# Altium project BMS.PrjPcb (part 1 of 2)
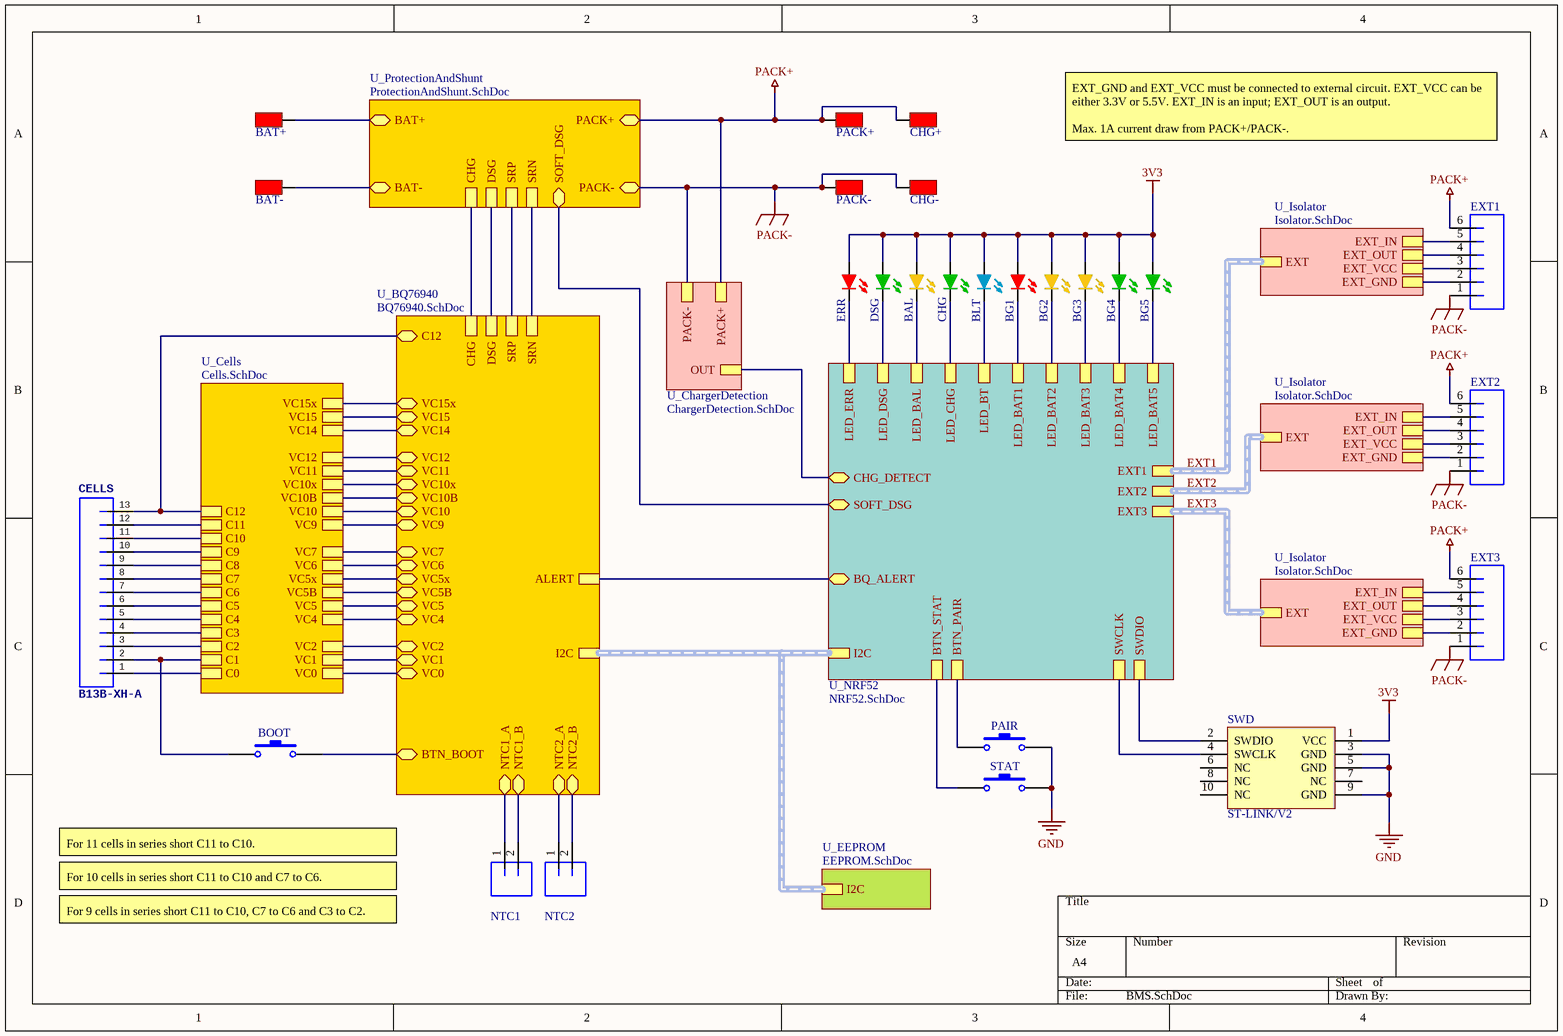
[diagram p0: BMS.SchDoc]
8 sheets, 242 parts. Net scope: hierarchical (ports join the sheet entries above them; power ports are global).
Board file: BMS.PcbDoc
Sheets:
  BMS.SchDoc
    U_BQ76940 = BQ76940.SchDoc
    U_ProtectionAndShunt = ProtectionAndShunt.SchDoc
    U_Isolator = Isolator.SchDoc
    U_Isolator = Isolator.SchDoc
    U_Isolator = Isolator.SchDoc
    U_EEPROM = EEPROM.SchDoc
    U_NRF52 = NRF52.SchDoc
    U_Cells = Cells.SchDoc
    U_ChargerDetection = ChargerDetection.SchDoc

## Sheet BMS.SchDoc
size A4

### Parts
BAL  LED  [LED0603]  (value not drawn)
BAT+  WIRE_LARGE  [WIRE_LARGE]  (value not drawn)
BAT-  WIRE_LARGE  [WIRE_LARGE]  (value not drawn)
BG1  LED  [LED0603]  (value not drawn)
BG2  LED  [LED0603]  (value not drawn)
BG3  LED  [LED0603]  (value not drawn)
BG4  LED  [LED0603]  (value not drawn)
BG5  LED  [LED0603]  (value not drawn)
BLT  LED  [LED0603]  (value not drawn)
BOOT  Button  [BUTTON]  (value not drawn)
CELLS  B13B-XH-A  [JST-13-PTH-VERT]
CHG  LED  [LED0603]  (value not drawn)
CHG+  WIRE_MEDIUM  [WIRE_MEDIUM]  (value not drawn)
CHG-  WIRE_MEDIUM  [WIRE_MEDIUM]  (value not drawn)
DSG  LED  [LED0603]  (value not drawn)
ERR  LED  [LED0603]  (value not drawn)
EXT1  EXT  [JST B6B-PH-K]  (value not drawn)
EXT2  EXT  [JST B6B-PH-K]  (value not drawn)
EXT3  EXT  [JST B6B-PH-K]  (value not drawn)
NTC1  TEMP  [JST-2-PTH-VERT]  (value not drawn)
NTC2  TEMP  [JST-2-PTH-VERT]  (value not drawn)
PACK+  WIRE_LARGE  [WIRE_LARGE]  (value not drawn)
PACK-  WIRE_LARGE  [WIRE_LARGE]  (value not drawn)
PAIR  Button  [BUTTON]  (value not drawn)
STAT  Button  [BUTTON]  (value not drawn)
SWD  ST-LINK/V2  [SWD]

### Sub-sheets
U_BQ76940 = BQ76940.SchDoc: ALERT, I2C (harness I2C), CHG, DSG, SRP, SRN, C12, VC10, VC7, VC5x, VC5B, VC1, VC2, VC15x, VC9, VC10x, VC5, VC12, VC6, VC10B, VC14, VC11, VC4, VC15, VC0, BTN_BOOT, NTC2_B, NTC1_A, NTC2_A, NTC1_B
U_Cells = Cells.SchDoc: VC15x, VC10x, VC5x, VC10, VC5, VC0, VC1, VC2, VC4, VC5B, VC6, VC7, VC9, VC10B, VC11, VC12, VC14, VC15, C11, C10, C9, C8, C7, C6, C5, C4, C3, C2, C1, C0, C12
U_ChargerDetection = ChargerDetection.SchDoc: PACK-, PACK+, OUT
U_EEPROM = EEPROM.SchDoc: I2C (harness I2C)
U_Isolator = Isolator.SchDoc: EXT (harness EXT), EXT_IN, EXT_OUT, EXT_VCC, EXT_GND
U_Isolator = Isolator.SchDoc: EXT (harness EXT), EXT_IN, EXT_OUT, EXT_VCC, EXT_GND
U_Isolator = Isolator.SchDoc: EXT (harness EXT), EXT_IN, EXT_OUT, EXT_VCC, EXT_GND
U_NRF52 = NRF52.SchDoc: SWDIO, SWCLK, BTN_PAIR, BTN_STAT, LED_BAT1, LED_BAT2, LED_BAT3, LED_BAT4, LED_BAT5, LED_CHG, LED_DSG, LED_BAL, LED_BT, LED_ERR, EXT3 (harness EXT), EXT2 (harness EXT), EXT1 (harness EXT), I2C (harness I2C), BQ_ALERT, CHG_DETECT, SOFT_DSG
U_ProtectionAndShunt = ProtectionAndShunt.SchDoc: SRP, SRN, CHG, DSG, BAT+, PACK+, PACK-, BAT-, SOFT_DSG

### Nets
3V3: BAL.A BG1.A BG2.A BG3.A BG4.A BG5.A BLT.A CHG.A DSG.A ERR.A SWD.1(VCC)
GND: PAIR.2 STAT.2 SWD.3(GND) SWD.5(GND) SWD.9(GND)
PACK+: BAT+.1 CHG+.1 EXT1.6 EXT2.6 EXT3.6 PACK+.1 ; sheet U_ProtectionAndShunt/BAT+, sheet U_ProtectionAndShunt/PACK+, sheet U_ChargerDetection/PACK+
PACK-: CHG-.1 EXT1.1 EXT2.1 EXT3.1 PACK-.1 ; sheet U_ProtectionAndShunt/PACK-, sheet U_ChargerDetection/PACK-
ALERT: sheet U_BQ76940/ALERT, sheet U_NRF52/BQ_ALERT
BAT-: BAT-.1 ; sheet U_ProtectionAndShunt/BAT-
BTN_BOOT: BOOT.2 ; sheet U_BQ76940/BTN_BOOT
BTN_PAIR: PAIR.1 ; sheet U_NRF52/BTN_PAIR
BTN_STAT: STAT.1 ; sheet U_NRF52/BTN_STAT
C0: CELLS.1 ; sheet U_Cells/C0
C1: BOOT.1 CELLS.2 ; sheet U_Cells/C1
C2: CELLS.3 ; sheet U_Cells/C2
C3: CELLS.4 ; sheet U_Cells/C3
C4: CELLS.5 ; sheet U_Cells/C4
C5: CELLS.6 ; sheet U_Cells/C5
C6: CELLS.7 ; sheet U_Cells/C6
C7: CELLS.8 ; sheet U_Cells/C7
C8: CELLS.9 ; sheet U_Cells/C8
C9: CELLS.10 ; sheet U_Cells/C9
C10: CELLS.11 ; sheet U_Cells/C10
C11: CELLS.12 ; sheet U_Cells/C11
C12: CELLS.13 ; sheet U_BQ76940/C12, sheet U_Cells/C12
CHG: sheet U_BQ76940/CHG, sheet U_ProtectionAndShunt/CHG
CHG_DETECT: sheet U_NRF52/CHG_DETECT, sheet U_ChargerDetection/OUT
DSG: sheet U_BQ76940/DSG, sheet U_ProtectionAndShunt/DSG
EXT_GND: EXT1.2 ; sheet U_Isolator/EXT_GND
EXT_GND: EXT2.2 ; sheet U_Isolator/EXT_GND  [a separate net that carries the same name]
EXT_GND: EXT3.2 ; sheet U_Isolator/EXT_GND  [a separate net that carries the same name]
EXT_IN: EXT1.5 ; sheet U_Isolator/EXT_IN
EXT_IN: EXT2.5 ; sheet U_Isolator/EXT_IN  [a separate net that carries the same name]
EXT_IN: EXT3.5 ; sheet U_Isolator/EXT_IN  [a separate net that carries the same name]
EXT_OUT: EXT1.4 ; sheet U_Isolator/EXT_OUT
EXT_OUT: EXT2.4 ; sheet U_Isolator/EXT_OUT  [a separate net that carries the same name]
EXT_OUT: EXT3.4 ; sheet U_Isolator/EXT_OUT  [a separate net that carries the same name]
EXT_VCC: EXT1.3 ; sheet U_Isolator/EXT_VCC
EXT_VCC: EXT2.3 ; sheet U_Isolator/EXT_VCC  [a separate net that carries the same name]
EXT_VCC: EXT3.3 ; sheet U_Isolator/EXT_VCC  [a separate net that carries the same name]
LED_BAL: BAL.C ; sheet U_NRF52/LED_BAL
LED_BAT1: BG1.C ; sheet U_NRF52/LED_BAT1
LED_BAT2: BG2.C ; sheet U_NRF52/LED_BAT2
LED_BAT3: BG3.C ; sheet U_NRF52/LED_BAT3
LED_BAT4: BG4.C ; sheet U_NRF52/LED_BAT4
LED_BAT5: BG5.C ; sheet U_NRF52/LED_BAT5
LED_BT: BLT.C ; sheet U_NRF52/LED_BT
LED_CHG: CHG.C ; sheet U_NRF52/LED_CHG
LED_DSG: DSG.C ; sheet U_NRF52/LED_DSG
LED_ERR: ERR.C ; sheet U_NRF52/LED_ERR
NTC1_A: NTC1.1 ; sheet U_BQ76940/NTC1_A
NTC2_A: NTC2.1 ; sheet U_BQ76940/NTC2_A
SOFT_DSG: sheet U_ProtectionAndShunt/SOFT_DSG, sheet U_NRF52/SOFT_DSG
SRN: sheet U_BQ76940/SRN, sheet U_ProtectionAndShunt/SRN
SRP: sheet U_BQ76940/SRP, sheet U_ProtectionAndShunt/SRP
SWCLK: SWD.4(SWCLK) ; sheet U_NRF52/SWCLK
SWDIO: SWD.2(SWDIO) ; sheet U_NRF52/SWDIO
VC0: sheet U_BQ76940/VC0, sheet U_Cells/VC0
VC1: sheet U_BQ76940/VC1, sheet U_Cells/VC1
VC2: sheet U_BQ76940/VC2, sheet U_Cells/VC2
VC4: sheet U_BQ76940/VC4, sheet U_Cells/VC4
VC5: sheet U_BQ76940/VC5, sheet U_Cells/VC5
VC5B: sheet U_BQ76940/VC5B, sheet U_Cells/VC5B
VC5x: NTC2.2 ; sheet U_BQ76940/VC5x, sheet U_BQ76940/NTC2_B, sheet U_Cells/VC5x
VC6: sheet U_BQ76940/VC6, sheet U_Cells/VC6
VC7: sheet U_BQ76940/VC7, sheet U_Cells/VC7
VC9: sheet U_BQ76940/VC9, sheet U_Cells/VC9
VC10: sheet U_BQ76940/VC10, sheet U_Cells/VC10
VC10B: sheet U_BQ76940/VC10B, sheet U_Cells/VC10B
VC10x: NTC1.2 ; sheet U_BQ76940/VC10x, sheet U_BQ76940/NTC1_B, sheet U_Cells/VC10x
VC11: sheet U_BQ76940/VC11, sheet U_Cells/VC11
VC12: sheet U_BQ76940/VC12, sheet U_Cells/VC12
VC14: sheet U_BQ76940/VC14, sheet U_Cells/VC14
VC15: sheet U_BQ76940/VC15, sheet U_Cells/VC15
VC15x: sheet U_BQ76940/VC15x, sheet U_Cells/VC15x

Not connected (* = marked no-connect by the designer): SWD 6(NC) 7(NC) 8(NC) 10(NC)

### Buses and harness runs
harness EXT1 = sheet U_Isolator/EXT = sheet U_NRF52/EXT1
harness EXT2 = sheet U_Isolator/EXT = sheet U_NRF52/EXT2
harness EXT3 = sheet U_Isolator/EXT = sheet U_NRF52/EXT3
harness sheet U_BQ76940/I2C = sheet U_EEPROM/I2C = sheet U_NRF52/I2C

### Notes on the sheet
- EXT_GND and EXT_VCC must be connected to external circuit. EXT_VCC can be either 3.3V or 5.5V. EXT_IN is an input; EXT_OUT is an output.
  Max. 1A current draw from PACK+/PACK-.
- For 11 cells in series short C11 to C10.
- For 10 cells in series short C11 to C10 and C7 to C6.
- For 9 cells in series short C11 to C10, C7 to C6 and C3 to C2.

### Library data of the parts
BAL BG2 BG3 = LED_YELLOW: PartNumber: LTST-C193TGKT-5A; Manufacturer: Lite-On Inc.; PackageReference: 0603; PackageDescription: 0603 (1608 Metric); Mounting Technology: Surface Mount
BG1 ERR = LED_RED: PartNumber: LTST-C193TGKT-5A; Manufacturer: Lite-On Inc.; PackageReference: 0603; PackageDescription: 0603 (1608 Metric); Mounting Technology: Surface Mount
BG4 BG5 CHG DSG = LED_GREEN: PartNumber: LTST-C193TGKT-5A; Manufacturer: Lite-On Inc.; PackageReference: 0603; PackageDescription: 0603 (1608 Metric); Mounting Technology: Surface Mount
BLT = LED_BLUE: PartNumber: LTST-C193TGKT-5A; Manufacturer: Lite-On Inc.; PackageReference: 0603; PackageDescription: 0603 (1608 Metric); Mounting Technology: Surface Mount
BOOT PAIR STAT = BUTTON: Push Button; pin to pad: 2>3; Published: 24-Mar-1999; LatestRevisionDate: 17-Jul-2002; LatestRevisionNote: Re-released for DXP Platform.; PackageReference: SPST-2; Publisher: Altium Limited; PackageDescription: Switch; 2 Leads
CELLS = JST_XH_13
EXT1-EXT3 = JST_PH_6_VERT: Manufacturer: JST Sales America, Inc.; Mounting Technology: Through Hole; PackageReference: JST-PH
NTC1 NTC2 = JST_PH_2_VERT: Manufacturer: JST Sales America, Inc.; PartNumber: B2B-PH-K-S(LF)(SN); Mounting Technology: Through Hole; PackageReference: JST-PH
SWD = SWD Connector

## Sheet BQ76940.SchDoc
size A4
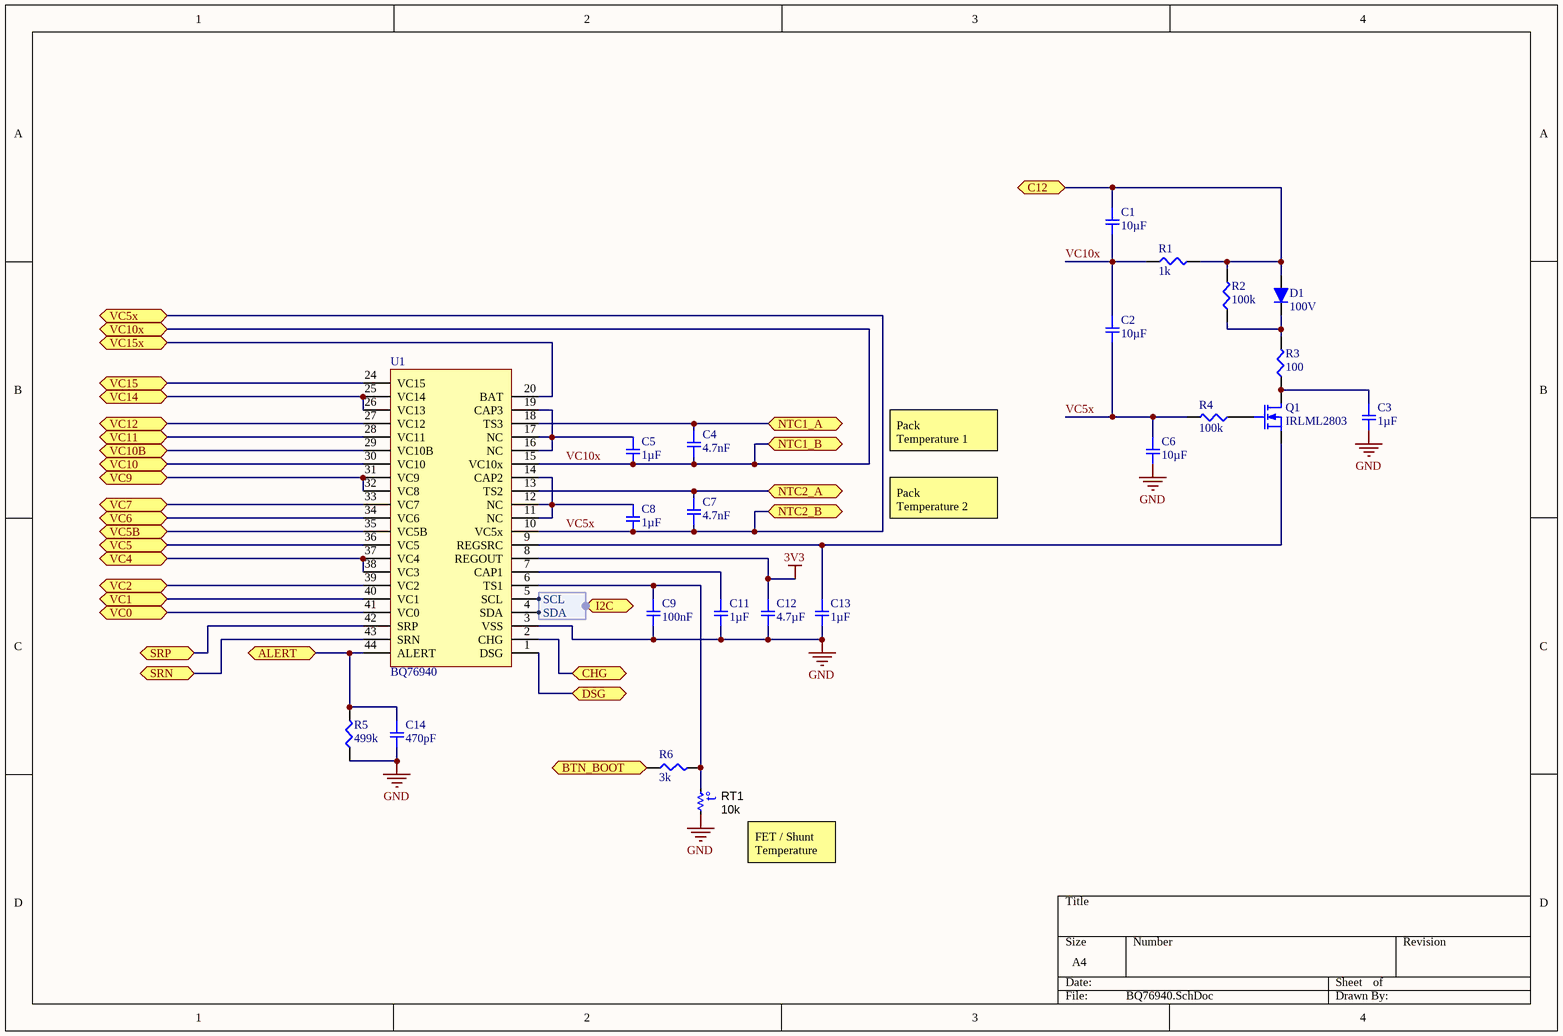
[diagram p1: BQ76940.SchDoc]

### Parts
C1  10µF  [SMD-0603C]
C2  10µF  [SMD-0603C]
C3  1µF  [SMD-0603C]
C4  4.7nF  [SMD-0603C]
C5  1µF  [SMD-0603C]
C6  10µF  [SMD-0603C]
C7  4.7nF  [SMD-0603C]
C8  1µF  [SMD-0603C]
C9  100nF  [SMD-0603C]
C11  1µF  [SMD-0603C]
C12  4.7µF  [SMD-0603C]
C13  1µF  [SMD-0603C]
C14  470pF  [SMD-0603C]
D1  100V  [SOD-323]
Q1  IRLML2803  [SOT23-3]
R1  1k  [SMD-0603-RES]
R2  100k  [SMD-0603-RES]
R3  100  [SMD-0603-RES]
R4  100k  [SMD-0603-RES]
R5  499k  [SMD-0603-RES]
R6  3k  [SMD-0603-RES]
RT1  value 10k  [SMD-0603-RES]  (hidden comment: NTC)
U1  BQ76940  [TSSOP44]

### Ports
ALERT, BTN_BOOT, C12, CHG, DSG, I2C (harness I2C), NTC1_A, NTC1_B, NTC2_A, NTC2_B, SRN, SRP, VC0, VC1, VC2, VC4, VC5, VC5B, VC5x, VC6, VC7, VC9, VC10, VC10B, VC10x, VC11, VC12, VC14, VC15, VC15x

### Harnesses
I2C: SCL, SDA

### Nets
3V3: C12.1 U1.8(REGOUT)
GND: C3.2 C6.2 C9.2 C11.2 C12.2 C13.2 C14.2 R5.1 RT1.1 U1.3(VSS)
ALERT: C14.1 R5.2 U1.44(ALERT) ; port ALERT
BTN_BOOT: R6.1 ; port BTN_BOOT
C12: C1.1 D1.2(A) R1.2 R2.2 ; port C12
CHG: U1.2(CHG) ; port CHG
DSG: U1.1(DSG) ; port DSG
NTC1_A: C4.1 U1.18(TS3) ; port NTC1_A
NTC2_A: C7.1 U1.13(TS2) ; port NTC2_A
SRN: U1.43(SRN) ; port SRN
SRP: U1.42(SRP) ; port SRP
VC0: U1.41(VC0) ; port VC0
VC1: U1.40(VC1) ; port VC1
VC2: U1.39(VC2) ; port VC2
VC4: U1.37(VC4) U1.38(VC3) ; port VC4
VC5: U1.36(VC5) ; port VC5
VC5B: U1.35(VC5B) ; port VC5B
VC5x: C2.2 C6.1 C7.2 C8.2 R4.2 U1.10(VC5x) ; port VC5x, port NTC2_B
VC6: U1.34(VC6) ; port VC6
VC7: U1.33(VC7) ; port VC7
VC9: U1.31(VC9) U1.32(VC8) ; port VC9
VC10: U1.30(VC10) ; port VC10
VC10B: U1.29(VC10B) ; port VC10B
VC10x: C1.2 C2.1 C4.2 C5.2 R1.1 U1.15(VC10x) ; port VC10x, port NTC1_B
VC11: U1.28(VC11) ; port VC11
VC12: U1.27(VC12) ; port VC12
VC14: U1.25(VC14) U1.26(VC13) ; port VC14
VC15: U1.24(VC15) ; port VC15
VC15x: U1.20(BAT) ; port VC15x
NetC3_1: C3.1 Q1.3(D) R3.1
NetC5_1: C5.1 U1.16(NC) U1.17(NC) U1.19(CAP3)
NetC8_1: C8.1 U1.11(NC) U1.12(NC) U1.14(CAP2)
NetC9_1: C9.1 R6.2 RT1.2 U1.6(TS1)
NetC11_1: C11.1 U1.7(CAP1)
NetC13_1: C13.1 Q1.2(S) U1.9(REGSRC)
NetD1_1: D1.1(K) R2.1 R3.2
NetM1_22: U1.4(SDA) ; port I2C.SDA
NetM1_23: U1.5(SCL) ; port I2C.SCL
NetQ1_1: Q1.1(G) R4.1

### Notes on the sheet
- Pack
  Temperature 1
- Pack
  Temperature 2
- (near RT1) FET / Shunt
  Temperature
- (in symbol NTC) t°

### Library data of the parts
C1 C2 C6 = GRM185R60J106ME15D: CAP CER 10UF 6.3V X5R 0603; Manufacturer: Murata Electronics North America; Factory Stock: 0; Unit Price (USD): 0.36; Minimum Quantity: 1; Tolerance: ±20%; Datasheets: http://www.murata.com/~/media/webrenewal/support/library/catalog/products/capacitor/mlcc/c02e.pdf; Image: //media.digikey.com/Renders/Murata%20Renders/ZRB-SERIES-0402.jpg; Digi-Key Part Number: 490-10467-1-ND; Part Number: GRM185R60J106ME15D; Quantity Available: 25068; @ qty: 0; Packaging: Cut Tape (CT); Series: GRM; Part Status: Active; Value: 10µF; Voltage: 6.3V; Temperature Coefficient: X5R; Operating Temperature: -55°C ~ 85°C; Features: Derating Recommended; Ratings: -; Applications: General Purpose; Mounting Type: Surface Mount, MLCC; Package / Case: 0603 (1608 Metric); Size / Dimension: 0.063" L x 0.031" W (1.60mm x 0.80mm); Height - Seated (Max): -; Thickness (Max): 0.022" (0.55mm); Lead Spacing: -; Lead Style: -
C3 C5 C8 C11 C13 = GCM188R71C105KA64D: CAP CER 1UF 16V X7R 0603; Manufacturer: Murata Electronics North America; Factory Stock: 0; Unit Price (USD): 0.24; Minimum Quantity: 1; Tolerance: ±10%; Datasheets: http://www.murata.com/~/media/webrenewal/support/library/catalog/products/capacitor/mlcc/c03e.ashx; Image: //media.digikey.com/Renders/Murata%20Renders/0603%28GCM188%29.jpg; Digi-Key Part Number: 490-5241-1-ND; Part Number: GCM188R71C105KA64D; Quantity Available: 9243; @ qty: 0; Packaging: Cut Tape (CT); Series: GCM; Part Status: Active; Value: 1µF; Voltage: 16V; Temperature Coefficient: X7R; Operating Temperature: -55°C ~ 125°C; Features: -; Ratings: AEC-Q200; Applications: Automotive; Mounting Type: Surface Mount, MLCC; Package / Case: 0603 (1608 Metric); Size / Dimension: 0.063" L x 0.031" W (1.60mm x 0.80mm); Height - Seated (Max): -; Thickness (Max): 0.035" (0.90mm); Lead Spacing: -; Lead Style: -
C4 C7 = GRJ188R71H472KE11D: CAP CER 4700PF 50V X7R 0603; Manufacturer: Murata Electronics North America; Factory Stock: 0; Unit Price (USD): 0.1; Minimum Quantity: 1; Tolerance: ±10%; Datasheets: http://www.murata.com/~/media/webrenewal/support/library/catalog/products/capacitor/mlcc/c02e.pdf; Image: //media.digikey.com/Renders/Murata%20Renders/0603%28LQG18%29.jpg; Digi-Key Part Number: 490-10897-1-ND; Part Number: GRJ188R71H472KE11D; Quantity Available: 7696; @ qty: 0; Packaging: Cut Tape (CT); Series: GRJ; Part Status: Active; Value: 4700pF; Voltage: 50V; Temperature Coefficient: X7R; Operating Temperature: -55°C ~ 125°C; Features: Soft Termination; Ratings: -; Applications: Boardflex Sensitive; Mounting Type: Surface Mount, MLCC; Package / Case: 0603 (1608 Metric); Size / Dimension: 0.063" L x 0.031" W (1.60mm x 0.80mm); Height - Seated (Max): -; Thickness (Max): 0.035" (0.90mm); Lead Spacing: -; Lead Style: -
C9 = GCJ188R71C104KA01D: CAP CER 0.1UF 16V X7R 0603; Manufacturer: Murata Electronics North America; Factory Stock: 0; Unit Price (USD): 0.21; Minimum Quantity: 1; Value: 0.10µF; Tolerance: ±10%; Datasheets: http://www.murata.com/~/media/webrenewal/support/library/catalog/products/capacitor/mlcc/c03e.ashx; Image: //media.digikey.com/Renders/Murata%20Renders/0603%28LQG18%29.jpg; Digi-Key Part Number: 490-5796-1-ND; Part Number: GCJ188R71C104KA01D; Quantity Available: 22473; @ qty: 0; Packaging: Cut Tape (CT); Series: GCJ; Part Status: Active; Voltage: 16V; Temperature Coefficient: X7R; Operating Temperature: -55°C ~ 125°C; Features: Soft Termination; Ratings: AEC-Q200; Applications: Automotive, Boardflex Sensitive; Mounting Type: Surface Mount, MLCC; Package / Case: 0603 (1608 Metric); Size / Dimension: 0.063" L x 0.031" W (1.60mm x 0.80mm); Height - Seated (Max): -; Thickness (Max): 0.035" (0.90mm); Lead Spacing: -; Lead Style: -
C12 = GRJ188C70J475KE11D: CAP CER 4.7UF 6.3V X7S 0603; Manufacturer: Murata Electronics North America; Factory Stock: 0; Unit Price (USD): 0.34; Minimum Quantity: 1; Tolerance: ±10%; Datasheets: http://www.murata.com/~/media/webrenewal/support/library/catalog/products/capacitor/mlcc/c02e.pdf; Image: //media.digikey.com/Renders/Murata%20Renders/0603%28LQG18%29.jpg; Digi-Key Part Number: 490-10884-1-ND; Part Number: GRJ188C70J475KE11D; Quantity Available: 9234; @ qty: 0; Packaging: Cut Tape (CT); Series: GRJ; Part Status: Active; Value: 4.7µF; Voltage: 6.3V; Temperature Coefficient: X7S; Operating Temperature: -55°C ~ 125°C; Features: Soft Termination; Ratings: -; Applications: Boardflex Sensitive; Mounting Type: Surface Mount, MLCC; Package / Case: 0603 (1608 Metric); Size / Dimension: 0.063" L x 0.031" W (1.60mm x 0.80mm); Height - Seated (Max): -; Thickness (Max): 0.039" (1.00mm); Lead Spacing: -; Lead Style: -
C14 = GCM1885C1H471JA16D: CAP CER 470PF 50V NP0 0603; Manufacturer: Murata Electronics North America; Factory Stock: 0; Unit Price (USD): 0.1; Minimum Quantity: 1; Tolerance: ±5%; Temperature Coefficient: C0G, NP0; Datasheets: http://www.murata.com/~/media/webrenewal/support/library/catalog/products/capacitor/mlcc/c03e.ashx; Image: //media.digikey.com/Renders/Murata%20Renders/0603%28GCM188%29.jpg; Digi-Key Part Number: 490-4965-1-ND; Part Number: GCM1885C1H471JA16D; Quantity Available: 32645; @ qty: 0; Packaging: Cut Tape (CT); Series: GCM; Part Status: Active; Value: 470pF; Voltage: 50V; Operating Temperature: -55°C ~ 125°C; Features: -; Ratings: AEC-Q200; Applications: Automotive; Mounting Type: Surface Mount, MLCC; Package / Case: 0603 (1608 Metric); Size / Dimension: 0.063" L x 0.031" W (1.60mm x 0.80mm); Height - Seated (Max): -; Thickness (Max): 0.035" (0.90mm); Lead Spacing: -; Lead Style: -
D1 = DIODE
Q1 = MOSFET-N: N-Channel MOSFET; Published: 8-Jun-2000; LatestRevisionDate: 17-Jul-2002; LatestRevisionNote: Re-released for DXP Platform.; PackageVersion: 1995/1996; PackageReference: E3; Publisher: Altium Limited; PackageDescription: TO, Flat Index; 3 In-Line, Axial Leads; Body Dia. 4.6mm; Lead Dia. 0.5 mm (max)
R1 = ERJ-3EKF1001V: RES SMD 1K OHM 1% 1/10W 0603; Manufacturer: Panasonic Electronic Components; Factory Stock: 0; Unit Price (USD): 0.00379; @ qty: 1500; Minimum Quantity: 1; Power (Watts): 0.1W, 1/10W; Temperature Coefficient: ±100ppm/°C; Part Number: ERJ-3EKF1001V; Datasheets: http://industrial.panasonic.com/www-cgi/jvcr13pz.cgi?E+PZ+3+AOA0002+ERJ3EKF1001V+7+WW; Image: //media.digikey.com/Photos/Panasonic%20Photos/MFG_ERJ-P6W%20Series.jpg; Digi-Key Part Number: P1.00KHCT-ND; Quantity Available: 5218845; Packaging: Cut Tape (CT); Series: ERJ; Part Status: Active; Value: 1k; Tolerance: ±1%; Composition: Thick Film; Features: Automotive AEC-Q200; Operating Temperature: -55°C ~ 155°C; Package / Case: 0603 (1608 Metric); Supplier Device Package: 0603; Size / Dimension: 0.063" L x 0.031" W (1.60mm x 0.80mm); Height - Seated (Max): 0.022" (0.55mm); Number of Terminations: 2; Failure Rate: -
R2 R4 = ERJ-3EKF1003V: RES SMD 100K OHM 1% 1/10W 0603; Manufacturer: Panasonic Electronic Components; Factory Stock: 0; Unit Price (USD): 0.00379; @ qty: 1500; Minimum Quantity: 1; Power (Watts): 0.1W, 1/10W; Temperature Coefficient: ±100ppm/°C; Part Number: ERJ-3EKF1003V; Datasheets: http://industrial.panasonic.com/www-cgi/jvcr13pz.cgi?E+PZ+3+AOA0002+ERJ3EKF1003V+7+WW; Image: //media.digikey.com/Photos/Panasonic%20Photos/MFG_ERJ-P6W%20Series.jpg; Digi-Key Part Number: P100KHCT-ND; Quantity Available: 2179804; Packaging: Cut Tape (CT); Series: ERJ; Part Status: Active; Value: 100k; Tolerance: ±1%; Composition: Thick Film; Features: Automotive AEC-Q200; Operating Temperature: -55°C ~ 155°C; Package / Case: 0603 (1608 Metric); Supplier Device Package: 0603; Size / Dimension: 0.063" L x 0.031" W (1.60mm x 0.80mm); Height - Seated (Max): 0.022" (0.55mm); Number of Terminations: 2; Failure Rate: -
R3 = ERJ-3EKF1000V: RES SMD 100 OHM 1% 1/10W 0603; Manufacturer: Panasonic Electronic Components; Factory Stock: 0; Unit Price (USD): 0.00379; @ qty: 1500; Minimum Quantity: 1; Power (Watts): 0.1W, 1/10W; Temperature Coefficient: ±100ppm/°C; Part Number: ERJ-3EKF1000V; Datasheets: http://industrial.panasonic.com/www-cgi/jvcr13pz.cgi?E+PZ+3+AOA0002+ERJ3EKF1000V+7+WW; Image: //media.digikey.com/Photos/Panasonic%20Photos/MFG_ERJ-P6W%20Series.jpg; Digi-Key Part Number: P100HCT-ND; Quantity Available: 1544120; Packaging: Cut Tape (CT); Series: ERJ; Part Status: Active; Value: 100; Tolerance: ±1%; Composition: Thick Film; Features: Automotive AEC-Q200; Operating Temperature: -55°C ~ 155°C; Package / Case: 0603 (1608 Metric); Supplier Device Package: 0603; Size / Dimension: 0.063" L x 0.031" W (1.60mm x 0.80mm); Height - Seated (Max): 0.022" (0.55mm); Number of Terminations: 2; Failure Rate: -
R5 = ERJ-3EKF4993V: RES SMD 499K OHM 1% 1/10W 0603; Manufacturer: Panasonic Electronic Components; Factory Stock: 0; Unit Price (USD): 0.00379; @ qty: 1500; Minimum Quantity: 1; Power (Watts): 0.1W, 1/10W; Temperature Coefficient: ±100ppm/°C; Part Number: ERJ-3EKF4993V; Datasheets: http://industrial.panasonic.com/www-cgi/jvcr13pz.cgi?E+PZ+3+AOA0002+ERJ3EKF4993V+7+WW; Image: //media.digikey.com/Photos/Panasonic%20Photos/MFG_ERJ-P6W%20Series.jpg; Digi-Key Part Number: P499KHCT-ND; Quantity Available: 110332; Packaging: Cut Tape (CT); Series: ERJ; Part Status: Active; Value: 499k; Tolerance: ±1%; Composition: Thick Film; Features: Automotive AEC-Q200; Operating Temperature: -55°C ~ 155°C; Package / Case: 0603 (1608 Metric); Supplier Device Package: 0603; Size / Dimension: 0.063" L x 0.031" W (1.60mm x 0.80mm); Height - Seated (Max): 0.022" (0.55mm); Number of Terminations: 2; Failure Rate: -
R6 = ERJ-3EKF3001V: RES SMD 3K OHM 1% 1/10W 0603; Manufacturer: Panasonic Electronic Components; Factory Stock: 0; Unit Price (USD): 0.00379; @ qty: 1500; Minimum Quantity: 1; Power (Watts): 0.1W, 1/10W; Temperature Coefficient: ±100ppm/°C; Part Number: ERJ-3EKF3001V; Datasheets: http://industrial.panasonic.com/www-cgi/jvcr13pz.cgi?E+PZ+3+AOA0002+ERJ3EKF3001V+7+WW; Image: //media.digikey.com/Photos/Panasonic%20Photos/MFG_ERJ-P6W%20Series.jpg; Digi-Key Part Number: P3.00KHCT-ND; Quantity Available: 43631; Packaging: Cut Tape (CT); Series: ERJ; Part Status: Active; Value: 3k; Tolerance: ±1%; Composition: Thick Film; Features: Automotive AEC-Q200; Operating Temperature: -55°C ~ 155°C; Package / Case: 0603 (1608 Metric); Supplier Device Package: 0603; Size / Dimension: 0.063" L x 0.031" W (1.60mm x 0.80mm); Height - Seated (Max): 0.022" (0.55mm); Number of Terminations: 2; Failure Rate: -
RT1 = NTC: Thermistor NTC, 10.0k ohm, 1%; Manufacturer: SEMITEC Corporation; PartNumber: 103AT-2; Tolerance_%: 1; Power_W: 0.01; TaMin_C: -50; TaMax_C: 110; U/M: EA; ComponentLink1URL: http://www.semitec.co.jp/english2/products/pdf/AT_Thermistor.pdf; PackageReference: Disc, 5x8.4 mm; SymbolVersion: 2008-11-25; ComponentLink1Description: Datasheet link; CompType: ThermistorNTC; Series: AT; MountType: TH; RoHS: Y; Published: 2009-09-22; Publisher: Texas Instruments; LatestRevisionDate: 2013-08-16; Supplier 1: Mouser; Supplier Part Number 1: 954-103AT-2

## Sheet ProtectionAndShunt.SchDoc
size A4
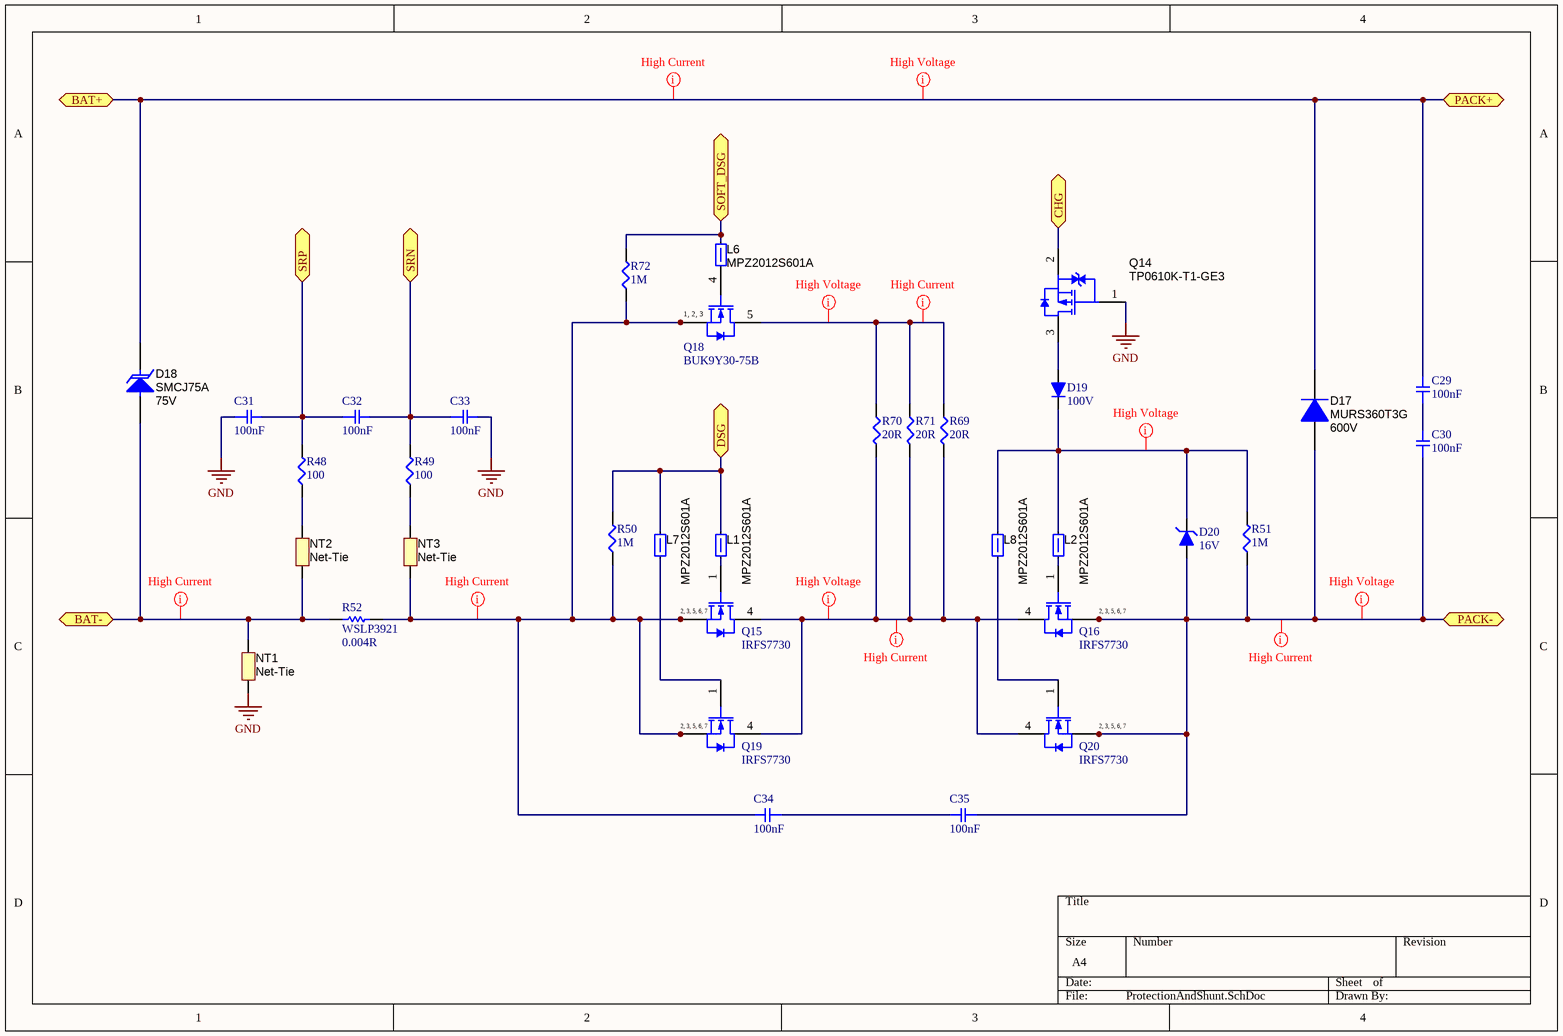
[diagram p2: ProtectionAndShunt.SchDoc]

### Parts
C29  100nF  [SMD-0603C]
C30  100nF  [SMD-0603C]
C31  100nF  [SMD-0603C]
C32  100nF  [SMD-0603C]
C33  100nF  [SMD-0603C]
C34  100nF  [SMD-0603C]
C35  100nF  [SMD-0603C]
D17  MURS360T3G  value 600V  [SMC]
D18  SMCJ75A  value 75V  [SMC]
D19  100V  [SOD-323]
D20  16V  [SOD-323]
L1  MPZ2012S601A  [SMD-0805-RES]
L2  MPZ2012S601A  [SMD-0805-RES]
L6  MPZ2012S601A  [SMD-0805-RES]
L7  MPZ2012S601A  [SMD-0805-RES]
L8  MPZ2012S601A  [SMD-0805-RES]
NT1  Net-Tie  [Net-Tie_10mil]  (net tie, no BOM)
NT2  Net-Tie  [Net-Tie_10mil]  (net tie, no BOM)
NT3  Net-Tie  [Net-Tie_10mil]  (net tie, no BOM)
Q14  TP0610K-T1-GE3  [SOT23-3]
Q15  IRFS7730  [INF-PG-TO263-7-3_N]
Q16  IRFS7730  [INF-PG-TO263-7-3_N]
Q18  BUK9Y30-75B  [NXP-SOT669_N]
Q19  IRFS7730  [INF-PG-TO263-7-3_N]
Q20  IRFS7730  [INF-PG-TO263-7-3_N]
R48  100  [SMD-0603-RES]
R49  100  [SMD-0603-RES]
R50  1M  [SMD-0603-RES]
R51  1M  [SMD-0603-RES]
R52  WSLP3921  value 0.004R  [WSLP3921]
R69  20R  [SMD-1206-RES]
R70  20R  [SMD-1206-RES]
R71  20R  [SMD-1206-RES]
R72  1M  [SMD-0603-RES]

### Ports
BAT+, BAT-, CHG, DSG, PACK+, PACK-, SOFT_DSG, SRN, SRP

### Nets
GND: C31.1 C33.2 NT1.1 Q14.1(G)
PACK+: C29.2 D17.1(K) D18.1(K) ; port BAT+, port PACK+
PACK-: C30.1 C35.1 D17.2(A) D20.2(A) Q16.2(SOURCE) Q16.3(SOURCE) Q16.5(SOURCE) Q16.6(SOURCE) Q16.7(SOURCE) Q20.2(SOURCE) Q20.3(SOURCE) Q20.5(SOURCE) Q20.6(SOURCE) Q20.7(SOURCE) R51.1 ; port PACK-
BAT-: D18.2(A) NT1.2 NT2.1 R52.1 ; port BAT-
CHG: Q14.2(S) ; port CHG
DSG: L1.2 L7.2 R50.2 ; port DSG
SOFT_DSG: L6.2 R72.2 ; port SOFT_DSG
SRN: C32.2 C33.1 R49.2 ; port SRN
SRP: C31.2 C32.1 R48.2 ; port SRP
NetC29_1: C29.1 C30.2
NetC34_1: C34.1 C35.2
NetC34_2: C34.2 NT3.1 Q15.2(SOURCE) Q15.3(SOURCE) Q15.5(SOURCE) Q15.6(SOURCE) Q15.7(SOURCE) Q18.1(S) Q18.2(S) Q18.3(S) Q19.2(SOURCE) Q19.3(SOURCE) Q19.5(SOURCE) Q19.6(SOURCE) Q19.7(SOURCE) R50.1 R52.2 R72.1
NetD19_1: D19.1(K) D20.1(K) L2.2 L8.2 R51.2
NetD19_2: D19.2(A) Q14.3(D)
NetL1_1: L1.1 Q15.1(GATE)
NetL2_1: L2.1 Q16.1(GATE)
NetL6_1: L6.1 Q18.4(G)
NetL7_1: L7.1 Q19.1(GATE)
NetL8_1: L8.1 Q20.1(GATE)
NetNT2_2: NT2.2 R48.1
NetNT3_2: NT3.2 R49.1
NetQ15_4: Q15.4(DRAIN) Q16.4(DRAIN) Q19.4(DRAIN) Q20.4(DRAIN) R69.2 R70.2 R71.2
NetQ18_5: Q18.5(D) R69.1 R70.1 R71.1

### Layout directives
net class High Voltage: NetD19_1, NetQ15_4, NetQ18_5, PACK+, PACK-
net class High Current: BAT-, NetC34_2, NetQ15_4, NetQ18_5, PACK+, PACK-

### Notes on the sheet
- (in symbol BUK9Y30-75B,115) 1, 2, 3
- (in symbol IPB180N04S3-02) 2, 3, 5, 6, 7

### Library data of the parts
C29-C35 = GCJ188R71C104KA01D: as C9 on sheet BQ76940; Datasheets: http://www.murata.com/~/media/webrenewal/support/library/catalog/products/capacitor/mlcc/c03e.ashx; Image: //media.digikey.com/Renders/Murata%20Renders/0603%28LQG18%29.jpg; Digi-Key Part Number: 490-5796-1-ND; Part Number: GCJ188R71C104KA01D; Quantity Available: 22473; @ qty: 0; Packaging: Cut Tape (CT); Series: GCJ; Part Status: Active; Voltage: 16V; Temperature Coefficient: X7R; Operating Temperature: -55°C ~ 125°C; Features: Soft Termination; Ratings: AEC-Q200; Applications: Automotive, Boardflex Sensitive; Mounting Type: Surface Mount, MLCC; Package / Case: 0603 (1608 Metric); Size / Dimension: 0.063" L x 0.031" W (1.60mm x 0.80mm); Height - Seated (Max): -; Thickness (Max): 0.035" (0.90mm); Lead Spacing: -; Lead Style: -
D17 = MURS360T3G: Diode, Ultrafast, 600V, 3A, SMC; Manufacturer: ON Semiconductor; U/M: EA; Vf_V: 1.25; Io_A: 3; Vr_V: 600; Value2: 1.25V; TJmax_C: 175; RJC_CperW: 11; CompType: Diode; PartNumber: MURS360T3G; SymbolVersion: 2008-12-08; MountType: SMT; RoHS: Y; PackageReference: SMC; Value1: 3A; Type: Ultrafast; Published: 2008-06-26; Publisher: Texas Instruments; LatestRevisionDate: 2014-01-16; ComponentLink1Description: Datasheet link; ComponentLink1URL: http://www.onsemi.com/pub/Collateral/MURS320T3-D.PDF; Supplier 1: Digi-Key; Supplier Part Number 1: MURS360T3GOSCT-ND; Supplier 2: Mouser; Supplier Part Number 2: 863-MURS360T3G; Supplier 3: Farnell; Supplier Part Number 3: 1459153
D18 = SMCJ75A: Diode, TVS, Uni, 75V, 1500W, SMC; Manufacturer: Fairchild Semiconductor; U/M: EA; Power_W: 1500; Vr_V: 75; CompType: TVS; SymbolVersion: 2012-01-13; PackageReference: SMC; PartNumber: SMCJ75A; RoHS: Y; MountType: SMT; ComponentLink1Description: Datasheet link; ComponentLink1URL: http://www.fairchildsemi.com/ds/SM/SMCJ100A.pdf; Publisher: Texas Instruments; LatestRevisionDate: 2013-10-23; LatestRevisionNote: Updated Supplier Data; Vz_V: N/A; Value1: 1500W; Published: 2008-10-08; Supplier 1: Digi-Key; Supplier Part Number 1: SMCJ75AFSCT-ND; Supplier 2: Mouser; Supplier Part Number 2: 512-SMCJ75A; Supplier 3: Farnell; Supplier Part Number 3: 9822992
D19 = DIODE
D20 = ZENER_16V: Zener Diode 16V
L1 L2 L6-L8 = BLM18SG221TN1D: Ferrite Bead; Manufacturer: MuRata; Imax_A: 2.5; DCR_ohm: 0.04; Value1: 0.04 ohm; Value2: 2.5A; ZTyp@100MHz_Ohm: 220; Value: 220 ohm; CompType: Ferrite Bead; SymbolVersion: 2009-06-02; PartNumber: BLM18SG221TN1D; MountType: SMT; PackageReference: 0603; Published: 2014-04-30; Publisher: Texas Instruments; LatestRevisionDate: 2015-05-26; ComponentLink1Description: Datasheet link; ComponentLink1URL: http://search.murata.co.jp/Ceramy/image/img/PDF/ENG/L0110S0100BLM18S.pdf; RoHS: Y; Supplier 1: Digi-Key; Supplier Part Number 1: 490-5225-1-ND; Supplier 2: Mouser; Supplier Part Number 2: 81-BLM18SG221TN1D; Supplier 3: Farnell; Supplier Part Number 3: 1515753
NT1-NT3 = Net-Tie: Single point connection between nets.; SymbolCreator: codlsc; SymbolVersion: 2009-07-01; MountType: SMT; Publisher: Texas Instruments; LatestRevisionDate: 2012-11-28; LatestRevisionNote: Added Alternate PartNumber and Alternate Manufacturer parameters to appropriate components.
Q14 = TP0610K-T1-GE3: MOSFET, P-CH, -60 V, -0.185 A, SOT-23; Manufacturer: Vishay-Siliconix; Alternate Manufacturer: None; SymbolCreator: a0411947; U/M: EA; ChType: P; Value: -60V; Value1: 10 ohm; Rdson45_ohm: 10; Value2: 1.7 nC; QgTyp_nC: 1.7; Vgs_V: 20; SymbolVersion: 2013-05-16; PartNumber: TP0610K-T1-GE3; PackageReference: SOT-23; CompType: MOSFET; VdsMax_V: -60; IdsMax_A: -0.185; RoHS: Y; MountType: SMT; Published: 2008-06-19; Publisher: Texas Instruments; LatestRevisionDate: 2015-06-05; LatestRevisionNote: Added parts.; ComponentLink1Description: Datasheet link; ComponentLink1URL: http://www.vishay.com/docs/71411/tp0610k.pdf; Supplier 1: Digi-Key; Supplier Part Number 1: TP0610K-T1-GE3CT-ND; Supplier 2: Mouser; Supplier Part Number 2: 781-TP0610K-T1-GE3; Supplier 3: Farnell; Supplier Part Number 3: 1794816
Q15 Q16 Q19 Q20 = IPB180N04S3-02: OptiMOS-T Power-Transistor, 40 V VDS, 180 A ID, PG-TO263-7-3, Reel, Green; Manufacturer: Infineon; Green: TRUE; ID (max): 180 A; IDpuls (max): 720 A; Ptot (max): 300 W; QG: 160 nC; RDS (on) (max) (@10V): 1.5 mOhm; RthJC (max): 0.5 K/W; VDS (max): 40 V; VGS(th) (max): 4 V; VGS(th) (min): 2.1 V; DatasheetVersion: Rev. 1.0; PackageReference: PG-TO263-7-3; PackageDescription: 7-Pin Plastic (Green) Transistor Single Outline Package, 10 x 9.25 mm Body, 1.27 mm Pitch; Supplier 1: Mouser; Supplier Part Number 1: 726-IPB180N04S302; Supplier 2: Digi-Key; Supplier Part Number 2: IPB180N04S3-02TR-ND; Supplier 3: Digi-Key; Supplier Part Number 3: IPB180N04S3-02CT-ND; Supplier 4: Digi-Key; Supplier Part Number 4: IPB180N04S3-02DKR-ND; Halogen-free: TRUE; Packing: Reel; Technology: OptiMOS-T; Mounting Technology: Surface Mount; PartNumber: IPB180N04S3-02; ComponentLink1Description: Manufacturer URL; ComponentLink1URL: http://www.infineon.com/; ComponentLink2Description: Datasheet; ComponentLink2URL: http://www.infineon.com/dgdl/IPB180N04S3-02_DS_1_0.pdf?folderId=db3a304412b407950112b42b75b74520&fileId=db3a304412b407950112b42ba6cf45ab&location=en.Products.Automotive_ICs.Automotive_MOSFETs.Single__N-Channel_40V_MOSFETs.DATASHEET.IPB180N04S3-02_DS_1_0.pdf; ComponentLink3Description: Package Specification; ComponentLink3URL: http://www.infineon.com/cms/packages/SMD_-_Surface_Mounted_Devices/P-PG-TO263/P-TO263-07-02x_-3.html?__locale=en
Q18 = BUK9Y30-75B,115: N-Channel TrenchMOS Logic Level FET, 75 V, 34 A, 5-Pin SOT669, Tape and Reel; Manufacturer: NXP Semiconductors; Automotive Qualified: Y; Channel Type: N; ID [max] (A): 34; IDM [max] (A): 137; Packing: Tape & Reel; Qr [typ] (nC): 115; VDS [max] (V): 75; VGSth [typ] (V): 1.5; DatasheetVersion: Rev. 04; PackageVersion: 13-02-27, 02/2013; PackageReference: SOT669; PackageDescription: 4-Pin Plastic Single-ended Surface Mounted Package, Body 4.9 x 3.95 mm, Pitch 1.27 mm; Supplier 1: Digi-Key; Supplier Part Number 1: 568-6236-2-ND; Supplier 2: Digi-Key; Supplier Part Number 2: 568-6236-1-ND; Supplier 3: Digi-Key; Supplier Part Number 3: 568-6236-6-ND; Supplier 4: Newark; Supplier Part Number 4: 79R1855; Supplier 5: Mouser; Supplier Part Number 5: 771-BUK9Y30-75B115; Mounting Technology: Surface Mount; Code_JEDEC: MO-235; PartNumber: BUK9Y30-75B,115; ComponentLink1Description: Manufacturer URL; ComponentLink1URL: http://www.nxp.com/; ComponentLink2Description: Datasheet; ComponentLink2URL: http://www.nxp.com/documents/data_sheet/BUK9Y30-75B.pdf; ComponentLink3Description: Package Specification; ComponentLink3URL: http://www.nxp.com/documents/outline_drawing/sot669_po.pdf
R48 R49 = ERJ-3EKF1000V: as R3 on sheet BQ76940; Part Number: ERJ-3EKF1000V; Datasheets: http://industrial.panasonic.com/www-cgi/jvcr13pz.cgi?E+PZ+3+AOA0002+ERJ3EKF1000V+7+WW; Image: //media.digikey.com/Photos/Panasonic%20Photos/MFG_ERJ-P6W%20Series.jpg; Digi-Key Part Number: P100HCT-ND; Quantity Available: 1544120; Packaging: Cut Tape (CT); Series: ERJ; Part Status: Active; Value: 100; Tolerance: ±1%; Composition: Thick Film; Features: Automotive AEC-Q200; Operating Temperature: -55°C ~ 155°C; Package / Case: 0603 (1608 Metric); Supplier Device Package: 0603; Size / Dimension: 0.063" L x 0.031" W (1.60mm x 0.80mm); Height - Seated (Max): 0.022" (0.55mm); Number of Terminations: 2; Failure Rate: -
R50 R51 R72 = ERJ-3GEYJ105V: RES SMD 1M OHM 5% 1/10W 0603; Manufacturer: Panasonic Electronic Components; Factory Stock: 0; Unit Price (USD): 0.00321; @ qty: 1500; Minimum Quantity: 1; Power (Watts): 0.1W, 1/10W; Temperature Coefficient: ±200ppm/°C; Part Number: ERJ-3GEYJ105V; Datasheets: http://industrial.panasonic.com/www-cgi/jvcr13pz.cgi?E+PZ+3+AOA0001+ERJ3GEYJ105V+7+WW; Image: //media.digikey.com/Photos/Panasonic%20Photos/MFG_ERJ-P6W%20Series.jpg; Digi-Key Part Number: P1.0MGCT-ND; Quantity Available: 250051; Packaging: Cut Tape (CT); Series: ERJ; Part Status: Active; Value: 1M; Tolerance: ±5%; Composition: Thick Film; Features: Automotive AEC-Q200; Operating Temperature: -55°C ~ 155°C; Package / Case: 0603 (1608 Metric); Supplier Device Package: 0603; Size / Dimension: 0.063" L x 0.031" W (1.60mm x 0.80mm); Height - Seated (Max): 0.022" (0.55mm); Number of Terminations: 2; Failure Rate: -
R69-R71 = ERJ-8ENF20R0V: RES SMD 20 OHM 1% 1/4W 1206; Manufacturer: Panasonic Electronic Components; Factory Stock: 0; Unit Price (USD): 0.00933; @ qty: 1500; Minimum Quantity: 1; Value: 20; Power (Watts): 0.25W, 1/4W; Temperature Coefficient: ±100ppm/°C; Part Number: ERJ-8ENF20R0V; Datasheets: http://industrial.panasonic.com/www-cgi/jvcr13pz.cgi?E+PZ+3+AOA0002+ERJ8ENF20R0V+7+WW; Image: //media.digikey.com/Renders/Panasonic%20Renders/ERJ-1206%20Pkg.jpg; Digi-Key Part Number: P20.0FCT-ND; Quantity Available: 622513; Packaging: Cut Tape (CT); Series: ERJ; Part Status: Active; Tolerance: ±1%; Composition: Thick Film; Features: Automotive AEC-Q200; Operating Temperature: -55°C ~ 155°C; Package / Case: 1206 (3216 Metric); Supplier Device Package: 1206; Size / Dimension: 0.126" L x 0.063" W (3.20mm x 1.60mm); Height - Seated (Max): 0.028" (0.70mm); Number of Terminations: 2; Failure Rate: -

## Sheet Isolator.SchDoc
size A4
Used 3 times, as channels U_Isolator, U_Isolator, U_Isolator. Parts and nets are listed once, with the designators drawn on the sheet.
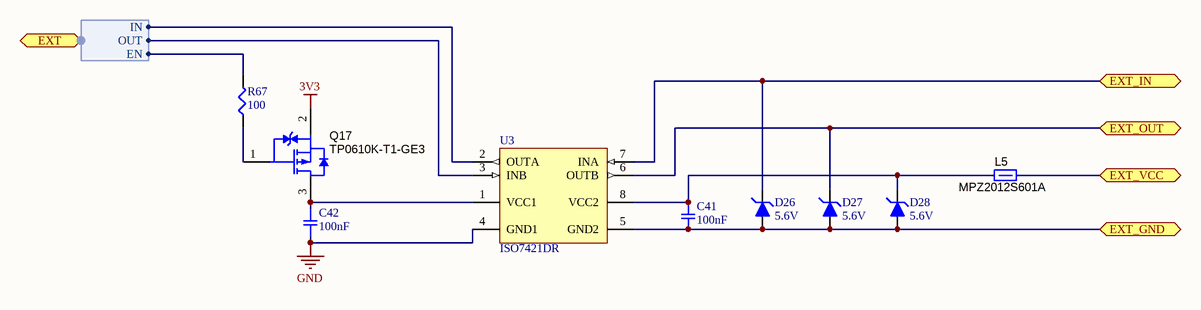
[diagram p3: Isolator.SchDoc]

### Parts
C41  100nF  [SMD-0603C]
C42  100nF  [SMD-0603C]
D26  5.6V  [SOD-323]
D27  5.6V  [SOD-323]
D28  5.6V  [SOD-323]
L5  MPZ2012S601A  [SMD-0805-RES]
Q17  TP0610K-T1-GE3  [SOT23-3]
R67  100  [SMD-0603-RES]
U3  ISO7421DR  [D0008A_N]

### Ports
EXT (harness EXT), EXT_GND, EXT_IN, EXT_OUT, EXT_VCC

### Harnesses
EXT: IN, OUT, EN

### Nets
3V3: Q17.2(S)
GND: C42.2 U3.4(GND1)
EXT_GND: C41.2 D26.2(A) D27.2(A) D28.2(A) U3.5(GND2) ; port EXT_GND
EXT_IN: D26.1(K) U3.7(INA) ; port EXT_IN
EXT_OUT: D27.1(K) U3.6(OUTB) ; port EXT_OUT
EXT_VCC: L5.1 ; port EXT_VCC
NetC41_1: C41.1 D28.1(K) L5.2 U3.8(VCC2)
NetC42_1: C42.1 Q17.3(D) U3.1(VCC1)
NetQ17_1: Q17.1(G) R67.1
NetR67_2: R67.2 ; port EXT.EN
NetU3_2: U3.2(OUTA) ; port EXT.IN
NetU3_3: U3.3(INB) ; port EXT.OUT

### Channels
U_Isolator: designators end in _U_Isolator#1; ports EXT_GND=EXT_GND EXT_IN=EXT_IN EXT_OUT=EXT_OUT EXT_VCC=EXT_VCC
U_Isolator: designators end in _U_Isolator#2; ports EXT_GND=EXT_GND EXT_IN=EXT_IN EXT_OUT=EXT_OUT EXT_VCC=EXT_VCC
U_Isolator: designators end in _U_Isolator#3; ports EXT_GND=EXT_GND EXT_IN=EXT_IN EXT_OUT=EXT_OUT EXT_VCC=EXT_VCC

### Library data of the parts
C41 C42 = GCJ188R71C104KA01D: as C9 on sheet BQ76940; Datasheets: http://www.murata.com/~/media/webrenewal/support/library/catalog/products/capacitor/mlcc/c03e.ashx; Image: //media.digikey.com/Renders/Murata%20Renders/0603%28LQG18%29.jpg; Digi-Key Part Number: 490-5796-1-ND; Part Number: GCJ188R71C104KA01D; Quantity Available: 22473; @ qty: 0; Packaging: Cut Tape (CT); Series: GCJ; Part Status: Active; Voltage: 16V; Temperature Coefficient: X7R; Operating Temperature: -55°C ~ 125°C; Features: Soft Termination; Ratings: AEC-Q200; Applications: Automotive, Boardflex Sensitive; Mounting Type: Surface Mount, MLCC; Package / Case: 0603 (1608 Metric); Size / Dimension: 0.063" L x 0.031" W (1.60mm x 0.80mm); Height - Seated (Max): -; Thickness (Max): 0.035" (0.90mm); Lead Spacing: -; Lead Style: -
D26-D28 = ZENER_5V6: Zener Diode 5.6V
L5 = BLM18SG221TN1D: as L1 on sheet ProtectionAndShunt; CompType: Ferrite Bead; SymbolVersion: 2009-06-02; PartNumber: BLM18SG221TN1D; MountType: SMT; PackageReference: 0603; Published: 2014-04-30; Publisher: Texas Instruments; LatestRevisionDate: 2015-05-26; ComponentLink1Description: Datasheet link; ComponentLink1URL: http://search.murata.co.jp/Ceramy/image/img/PDF/ENG/L0110S0100BLM18S.pdf; RoHS: Y; Supplier 1: Digi-Key; Supplier Part Number 1: 490-5225-1-ND; Supplier 2: Mouser; Supplier Part Number 2: 81-BLM18SG221TN1D; Supplier 3: Farnell; Supplier Part Number 3: 1515753
Q17 = TP0610K-T1-GE3: as Q14 on sheet ProtectionAndShunt; SymbolVersion: 2013-05-16; PartNumber: TP0610K-T1-GE3; PackageReference: SOT-23; CompType: MOSFET; VdsMax_V: -60; IdsMax_A: -0.185; RoHS: Y; MountType: SMT; Published: 2008-06-19; Publisher: Texas Instruments; LatestRevisionDate: 2015-06-05; LatestRevisionNote: Added parts.; ComponentLink1Description: Datasheet link; ComponentLink1URL: http://www.vishay.com/docs/71411/tp0610k.pdf; Supplier 1: Digi-Key; Supplier Part Number 1: TP0610K-T1-GE3CT-ND; Supplier 2: Mouser; Supplier Part Number 2: 781-TP0610K-T1-GE3; Supplier 3: Farnell; Supplier Part Number 3: 1794816
R67 = ERJ-3EKF1000V: as R3 on sheet BQ76940; Part Number: ERJ-3EKF1000V; Datasheets: http://industrial.panasonic.com/www-cgi/jvcr13pz.cgi?E+PZ+3+AOA0002+ERJ3EKF1000V+7+WW; Image: //media.digikey.com/Photos/Panasonic%20Photos/MFG_ERJ-P6W%20Series.jpg; Digi-Key Part Number: P100HCT-ND; Quantity Available: 1544120; Packaging: Cut Tape (CT); Series: ERJ; Part Status: Active; Value: 100; Tolerance: ±1%; Composition: Thick Film; Features: Automotive AEC-Q200; Operating Temperature: -55°C ~ 155°C; Package / Case: 0603 (1608 Metric); Supplier Device Package: 0603; Size / Dimension: 0.063" L x 0.031" W (1.60mm x 0.80mm); Height - Seated (Max): 0.022" (0.55mm); Number of Terminations: 2; Failure Rate: -
U3 = ISO7421DR: 1 Mbps Dual Channels, 1 / 1, Digital Isolator, 3.3 V / 5 V, -40 to +105 degC, 8-pin SOIC (D), Green (RoHS & no Sb/Br); Manufacturer: Texas Instruments; Datarate(Mbps): 1; Input Noise Filter: None; Insulation Rating(VRMS): 2500; Prop Delay(Max)(ns): 12; Rating: Catalog; Supply Voltage(s)(V): 3.3, 5; TTL/CMOS Input Threshold: TTL; DatasheetVersion: SLLS984E; PackageVersion: 4040047-3/M, 06/2011; PackageReference: D0008A; PackageDescription: 8-Pin Plastic Small Outline, Body 4.9 x 3.9 mm, Pitch 1.27 mm; Supplier 1: Digi-Key; Supplier Part Number 1: ISO7421DR-ND; Supplier 2: Newark; Supplier Part Number 2: 50R7698; Supplier 3: Mouser; Supplier Part Number 3: 595-ISO7421DR; SubFamily: Isolator; Thermal Shutdown: No; MountType: SMT; Code_JEDEC: MS-012; PartNumber: ISO7421DR; ComponentLink1Description: Manufacturer URL; ComponentLink1URL: http://www.ti.com/; ComponentLink2Description: Datasheet; ComponentLink2URL: http://www.ti.com/general/docs/lit/getliterature.tsp?genericPartNumber=ISO7421&fileType=pdf; ComponentLink3Description: Package Specification; ComponentLink3URL: http://www.ti.com/litv/pdf/msoi002j; ComponentLink4Description: SamplesURL; ComponentLink4URL: http://www.ti.com/product/iso7421#samples

## Sheet EEPROM.SchDoc
size A4
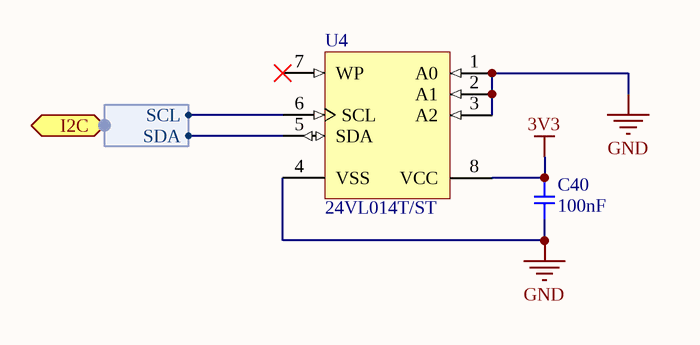
[diagram p4: EEPROM.SchDoc]

### Parts
C40  100nF  [SMD-0603C]
U4  24VL014T/ST  [TSSOP-ST8_N]

### Ports
I2C (harness I2C)

### Harnesses
I2C: SCL, SDA

### Nets
3V3: C40.1 U4.8(VCC)
GND: C40.2 U4.1(A0) U4.2(A1) U4.3(A2) U4.4(VSS)
NetM1_22: U4.5(SDA) ; port I2C.SDA
NetM1_23: U4.6(SCL) ; port I2C.SCL

Not connected (* = marked no-connect by the designer): U4 7(WP)*

### Library data of the parts
C40 = GCJ188R71C104KA01D: as C9 on sheet BQ76940; Datasheets: http://www.murata.com/~/media/webrenewal/support/library/catalog/products/capacitor/mlcc/c03e.ashx; Image: //media.digikey.com/Renders/Murata%20Renders/0603%28LQG18%29.jpg; Digi-Key Part Number: 490-5796-1-ND; Part Number: GCJ188R71C104KA01D; Quantity Available: 22473; @ qty: 0; Packaging: Cut Tape (CT); Series: GCJ; Part Status: Active; Voltage: 16V; Temperature Coefficient: X7R; Operating Temperature: -55°C ~ 125°C; Features: Soft Termination; Ratings: AEC-Q200; Applications: Automotive, Boardflex Sensitive; Mounting Type: Surface Mount, MLCC; Package / Case: 0603 (1608 Metric); Size / Dimension: 0.063" L x 0.031" W (1.60mm x 0.80mm); Height - Seated (Max): -; Thickness (Max): 0.035" (0.90mm); Lead Spacing: -; Lead Style: -
U4 = 24VL014T/ST: 1K I2C Serial EEPROM, 8-Pin TSSOP, Industrial Temperature, Tape and Reel; Manufacturer: Microchip; DatasheetVersion: revA, Jan-2009; PackageVersion: revBB, Aug-2009; PackageReference: TSSOP-ST8; PackageDescription: 8-Lead Plastic Thin Shrink Small Outline (ST) - 4.4mm Body [TSSOP]; Supplier 1: Digi-Key; Supplier Part Number 1: 24VL014T/ST-ND; Supplier 2: Mouser; Supplier Part Number 2: 579-24VL014T/ST; Mounting Technology: Surface Mount; Code_JEDEC: MO-153; PartNumber: 24VL014T/ST; ComponentLink1Description: Manufacturer URL; ComponentLink1URL: http://www.microchip.com/; ComponentLink2Description: Datasheet; ComponentLink2URL: http://ww1.microchip.com/downloads/en/DeviceDoc/22129A.pdf; ComponentLink3Description: Package Specification; ComponentLink3URL: http://www.microchip.com/stellent/groups/techpub_sg/documents/packagingspec/en012702.pdf

## Sheet NRF52.SchDoc
size A4
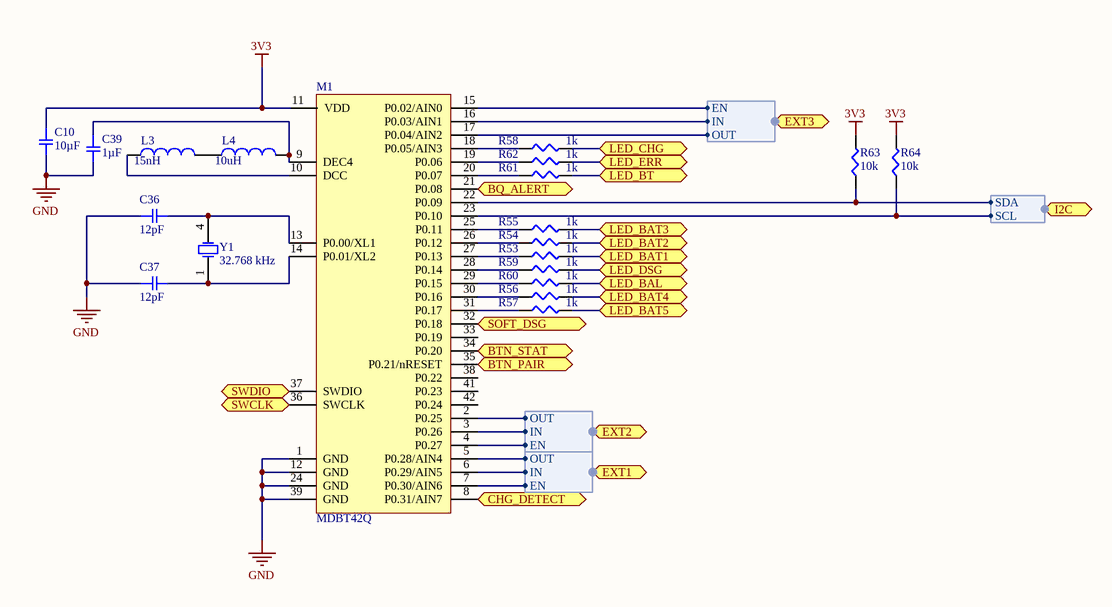
[diagram p5: NRF52.SchDoc]

### Parts
C10  10µF  [SMD-0603C]
C36  12pF  [SMD-0603C]
C37  12pF  [SMD-0603C]
C39  1µF  [SMD-0603C]
L3  value 15nH  [0402-A]  (hidden comment: Inductor)
L4  value 10uH  [0402-A]  (hidden comment: Inductor)
M1  MDBT42Q  [MDBT42Q]
R53  1k  [SMD-0603-RES]
R54  1k  [SMD-0603-RES]
R55  1k  [SMD-0603-RES]
R56  1k  [SMD-0603-RES]
R57  1k  [SMD-0603-RES]
R58  1k  [SMD-0603-RES]
R59  1k  [SMD-0603-RES]
R60  1k  [SMD-0603-RES]
R61  1k  [SMD-0603-RES]
R62  1k  [SMD-0603-RES]
R63  10k  [SMD-0603-RES]
R64  10k  [SMD-0603-RES]
Y1  32.768 kHz  [LFXTAL]

### Ports
BQ_ALERT, BTN_PAIR, BTN_STAT, CHG_DETECT, EXT1 (harness EXT), EXT2 (harness EXT), EXT3 (harness EXT), I2C (harness I2C), LED_BAL, LED_BAT1, LED_BAT2, LED_BAT3, LED_BAT4, LED_BAT5, LED_BT, LED_CHG, LED_DSG, LED_ERR, SOFT_DSG, SWCLK, SWDIO

### Harnesses
EXT: IN, OUT, EN
I2C: SCL, SDA

### Nets
3V3: C10.1 M1.11(VDD) R63.2 R64.2
GND: C10.2 C36.1 C37.1 C39.2 M1.1(GND) M1.12(GND) M1.24(GND) M1.39(GND)
ALERT: M1.21(P0.08) ; port BQ_ALERT
BTN_PAIR: M1.35(P0.21/nRESET) ; port BTN_PAIR
BTN_STAT: M1.34(P0.20) ; port BTN_STAT
CHG_DETECT: M1.8(P0.31/AIN7) ; port CHG_DETECT
EXT1.EN: M1.7(P0.30/AIN6) ; port EXT1.EN
EXT1.IN: M1.6(P0.29/AIN5) ; port EXT1.IN
EXT1.OUT: M1.5(P0.28/AIN4) ; port EXT1.OUT
EXT2.EN: M1.4(P0.27) ; port EXT2.EN
EXT2.IN: M1.3(P0.26) ; port EXT2.IN
EXT2.OUT: M1.2(P0.25) ; port EXT2.OUT
EXT3.EN: M1.15(P0.02/AIN0) ; port EXT3.EN
EXT3.IN: M1.16(P0.03/AIN1) ; port EXT3.IN
EXT3.OUT: M1.17(P0.04/AIN2) ; port EXT3.OUT
LED_BAL: R60.2 ; port LED_BAL
LED_BAT1: R53.2 ; port LED_BAT1
LED_BAT2: R54.2 ; port LED_BAT2
LED_BAT3: R55.2 ; port LED_BAT3
LED_BAT4: R56.2 ; port LED_BAT4
LED_BAT5: R57.2 ; port LED_BAT5
LED_BT: R61.2 ; port LED_BT
LED_CHG: R58.2 ; port LED_CHG
LED_DSG: R59.2 ; port LED_DSG
LED_ERR: R62.2 ; port LED_ERR
SOFT_DSG: M1.32(P0.18) ; port SOFT_DSG
SWCLK: M1.36(SWCLK) ; port SWCLK
SWDIO: M1.37(SWDIO) ; port SWDIO
NetC36_2: C36.2 M1.13(P0.00/XL1) Y1.4(OSC2)
NetC37_2: C37.2 M1.14(P0.01/XL2) Y1.1(OSC1)
NetC39_1: C39.1 L4.2 M1.9(DEC4)
NetL3_1: L3.1 M1.10(DCC)
NetL3_2: L3.2 L4.1
NetM1_18: M1.18(P0.05/AIN3) R58.1
NetM1_19: M1.19(P0.06) R62.1
NetM1_20: M1.20(P0.07) R61.1
NetM1_22: M1.22(P0.09) R63.1 ; port I2C.SDA
NetM1_23: M1.23(P0.10) R64.1 ; port I2C.SCL
NetM1_25: M1.25(P0.11) R55.1
NetM1_26: M1.26(P0.12) R54.1
NetM1_27: M1.27(P0.13) R53.1
NetM1_28: M1.28(P0.14) R59.1
NetM1_29: M1.29(P0.15) R60.1
NetM1_30: M1.30(P0.16) R56.1
NetM1_31: M1.31(P0.17) R57.1

Not connected (* = marked no-connect by the designer): M1 33(P0.19) 38(P0.22) 41(P0.23) 42(P0.24)

### Library data of the parts
C10 = GRM185R60J106ME15D: as C1 on sheet BQ76940; Datasheets: http://www.murata.com/~/media/webrenewal/support/library/catalog/products/capacitor/mlcc/c02e.pdf; Image: //media.digikey.com/Renders/Murata%20Renders/ZRB-SERIES-0402.jpg; Digi-Key Part Number: 490-10467-1-ND; Part Number: GRM185R60J106ME15D; Quantity Available: 25068; @ qty: 0; Packaging: Cut Tape (CT); Series: GRM; Part Status: Active; Value: 10µF; Voltage: 6.3V; Temperature Coefficient: X5R; Operating Temperature: -55°C ~ 85°C; Features: Derating Recommended; Ratings: -; Applications: General Purpose; Mounting Type: Surface Mount, MLCC; Package / Case: 0603 (1608 Metric); Size / Dimension: 0.063" L x 0.031" W (1.60mm x 0.80mm); Height - Seated (Max): -; Thickness (Max): 0.022" (0.55mm); Lead Spacing: -; Lead Style: -
C36 C37 = GCM1885C1H120JA16D: CAP CER 12PF 50V NP0 0603; Manufacturer: Murata Electronics North America; Factory Stock: 0; Unit Price (USD): 0.1; Minimum Quantity: 1; Tolerance: ±5%; Temperature Coefficient: C0G, NP0; Datasheets: http://www.murata.com/~/media/webrenewal/support/library/catalog/products/capacitor/mlcc/c03e.ashx; Image: //media.digikey.com/Renders/Murata%20Renders/0603%28GCM188%29.jpg; Digi-Key Part Number: 490-6045-1-ND; Part Number: GCM1885C1H120JA16D; Quantity Available: 35071; @ qty: 0; Packaging: Cut Tape (CT); Series: GCM; Part Status: Active; Value: 12pF; Voltage: 50V; Operating Temperature: -55°C ~ 125°C; Features: -; Ratings: AEC-Q200; Applications: Automotive; Mounting Type: Surface Mount, MLCC; Package / Case: 0603 (1608 Metric); Size / Dimension: 0.063" L x 0.031" W (1.60mm x 0.80mm); Height - Seated (Max): -; Thickness (Max): 0.035" (0.90mm); Lead Spacing: -; Lead Style: -
C39 = GCM188R71C105KA64D: as C3 on sheet BQ76940; Datasheets: http://www.murata.com/~/media/webrenewal/support/library/catalog/products/capacitor/mlcc/c03e.ashx; Image: //media.digikey.com/Renders/Murata%20Renders/0603%28GCM188%29.jpg; Digi-Key Part Number: 490-5241-1-ND; Part Number: GCM188R71C105KA64D; Quantity Available: 9243; @ qty: 0; Packaging: Cut Tape (CT); Series: GCM; Part Status: Active; Value: 1µF; Voltage: 16V; Temperature Coefficient: X7R; Operating Temperature: -55°C ~ 125°C; Features: -; Ratings: AEC-Q200; Applications: Automotive; Mounting Type: Surface Mount, MLCC; Package / Case: 0603 (1608 Metric); Size / Dimension: 0.063" L x 0.031" W (1.60mm x 0.80mm); Height - Seated (Max): -; Thickness (Max): 0.035" (0.90mm); Lead Spacing: -; Lead Style: -
L3 L4 = Inductor: Code_IEC: 1005; Published: 8-Jun-2000; LatestRevisionDate: 29-May-2009; LatestRevisionNote: IPC-7351 Footprint Added.; PackageReference: 0402-A; Publisher: Altium Limited; PackageDescription: Chip Inductor; Code_JEITA: 0402
M1 = MDBT42Q: nRF52832 module
R53-R62 = ERJ-3EKF1001V: as R1 on sheet BQ76940; Part Number: ERJ-3EKF1001V; Datasheets: http://industrial.panasonic.com/www-cgi/jvcr13pz.cgi?E+PZ+3+AOA0002+ERJ3EKF1001V+7+WW; Image: //media.digikey.com/Photos/Panasonic%20Photos/MFG_ERJ-P6W%20Series.jpg; Digi-Key Part Number: P1.00KHCT-ND; Quantity Available: 5218845; Packaging: Cut Tape (CT); Series: ERJ; Part Status: Active; Value: 1k; Tolerance: ±1%; Composition: Thick Film; Features: Automotive AEC-Q200; Operating Temperature: -55°C ~ 155°C; Package / Case: 0603 (1608 Metric); Supplier Device Package: 0603; Size / Dimension: 0.063" L x 0.031" W (1.60mm x 0.80mm); Height - Seated (Max): 0.022" (0.55mm); Number of Terminations: 2; Failure Rate: -
R63 R64 = ERJ-3EKF1002V: RES SMD 10K OHM 1% 1/10W 0603; Manufacturer: Panasonic Electronic Components; Factory Stock: 0; Unit Price (USD): 0.00379; @ qty: 1500; Minimum Quantity: 1; Power (Watts): 0.1W, 1/10W; Temperature Coefficient: ±100ppm/°C; Part Number: ERJ-3EKF1002V; Datasheets: http://industrial.panasonic.com/www-cgi/jvcr13pz.cgi?E+PZ+3+AOA0002+ERJ3EKF1002V+7+WW; Image: //media.digikey.com/Photos/Panasonic%20Photos/MFG_ERJ-P6W%20Series.jpg; Digi-Key Part Number: P10.0KHCT-ND; Quantity Available: 6703141; Packaging: Cut Tape (CT); Series: ERJ; Part Status: Active; Value: 10k; Tolerance: ±1%; Composition: Thick Film; Features: Automotive AEC-Q200; Operating Temperature: -55°C ~ 155°C; Package / Case: 0603 (1608 Metric); Supplier Device Package: 0603; Size / Dimension: 0.063" L x 0.031" W (1.60mm x 0.80mm); Height - Seated (Max): 0.022" (0.55mm); Number of Terminations: 2; Failure Rate: -
Y1 = LFXTAL016178: Published: 8-Jun-2000; LatestRevisionDate: 17-Jul-2002; LatestRevisionNote: Re-released for DXP Platform.; PackageReference: R38; Publisher: Altium Limited; PackageDescription: Crystal, Thru-Hole; 2 Leads; Body 3.1 x 8.2 mm (Dia.xH)